# Altium schematic sheet SupplyMonitoring.SchDoc
size A4; SheetNumber: 9
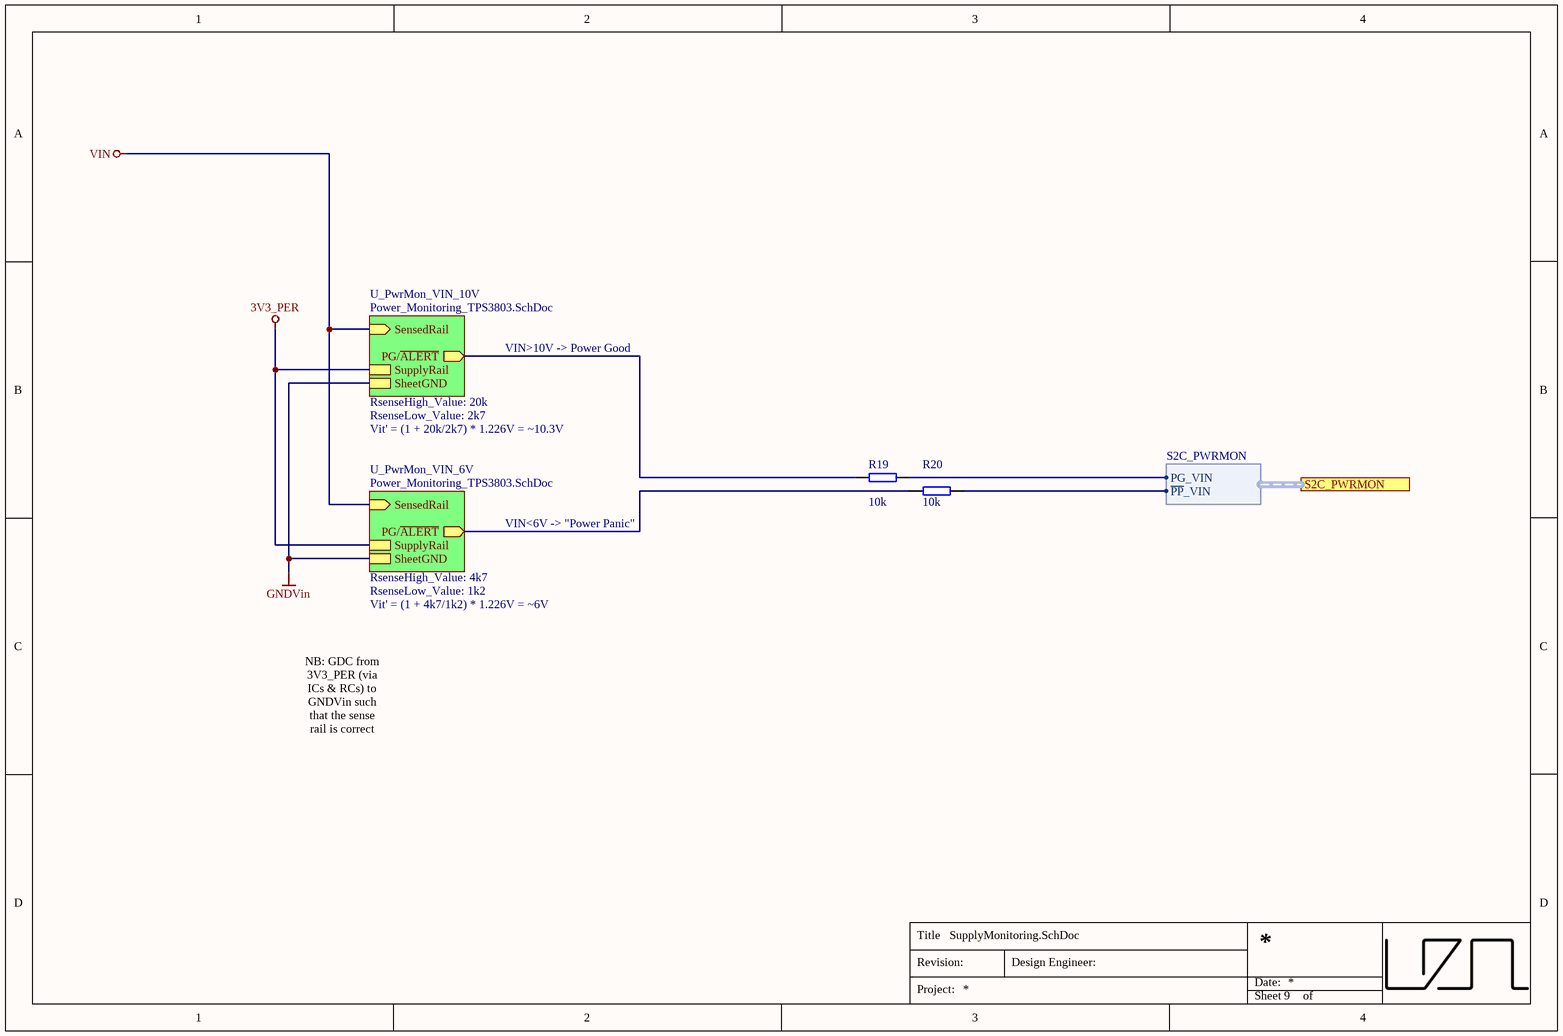
[diagram p0: SupplyMonitoring.SchDoc]

## Parts
R19  10k  [R_0603_TE]
R20  10k  [R_0603_TE]

## Sub-sheets
U_PwrMon_VIN_6V = Power_Monitoring_TPS3803.SchDoc: SensedRail (in), PG/~{ALERT} (out), SupplyRail, SheetGND  | RsenseHigh_Value: 4k7; RsenseLow_Value: 1k2; SubSheet_SheetNumber: 10.1
U_PwrMon_VIN_10V = Power_Monitoring_TPS3803.SchDoc: SensedRail (in), PG/~{ALERT} (out), SupplyRail, SheetGND  | RsenseHigh_Value: 20k; RsenseLow_Value: 2k7; SubSheet_SheetNumber: 10.2

## Ports
S2C_PWRMON (harness S2C_PWRMON)

## Harnesses
S2C_PWRMON: PG_VIN, ~{PP}_VIN

## Nets
3V3_PER: sheet U_PwrMon_VIN_10V/SupplyRail, sheet U_PwrMon_VIN_6V/SupplyRail
GNDVin: sheet U_PwrMon_VIN_10V/SheetGND, sheet U_PwrMon_VIN_6V/SheetGND
VIN: sheet U_PwrMon_VIN_10V/SensedRail, sheet U_PwrMon_VIN_6V/SensedRail
NetR19_1: R19.1 ; sheet U_PwrMon_VIN_10V/PG/~{ALERT}
NetR19_2: R19.2 ; port S2C_PWRMON.PG_VIN
NetR20_1: R20.1 ; sheet U_PwrMon_VIN_6V/PG/~{ALERT}
NetR20_2: R20.2 ; port S2C_PWRMON.~{PP}_VIN

## Notes on the sheet
- VIN>10V -> Power Good
- Vit' = (1 + 20k/2k7) * 1.226V = ~10.3V
- VIN<6V -> "Power Panic"
- Vit' = (1 + 4k7/1k2) * 1.226V = ~6V
- NB: GDC from 3V3_PER (via ICs & RCs) to GNDVin such that the sense rail is correct
- Title
- Revision:
- Design Engineer:
- Date:
- Project:
- Sheet
- of

## Library data of the parts
R19 R20 = UZgen_R_0603_10k: Generic resistor; Manufacturer: UZgen; Tolerance: 1 %; Created from: AGeiger; Value: 10k; Manufacturer Part Number: UZgen_R_0603_10k; PartID: 1; Created On: 02/07/2024 14:34:53; Device Package: 0603; Mounting Type: SMD; Last Updated: 02/07/2024 14:37:16